# Altium schematic sheet homecomputer-6502_0.SchDoc: homecomputer-6502
size 286 x 202 mm; Date: 2018/12/4 21:08:21; SheetNumber: 1
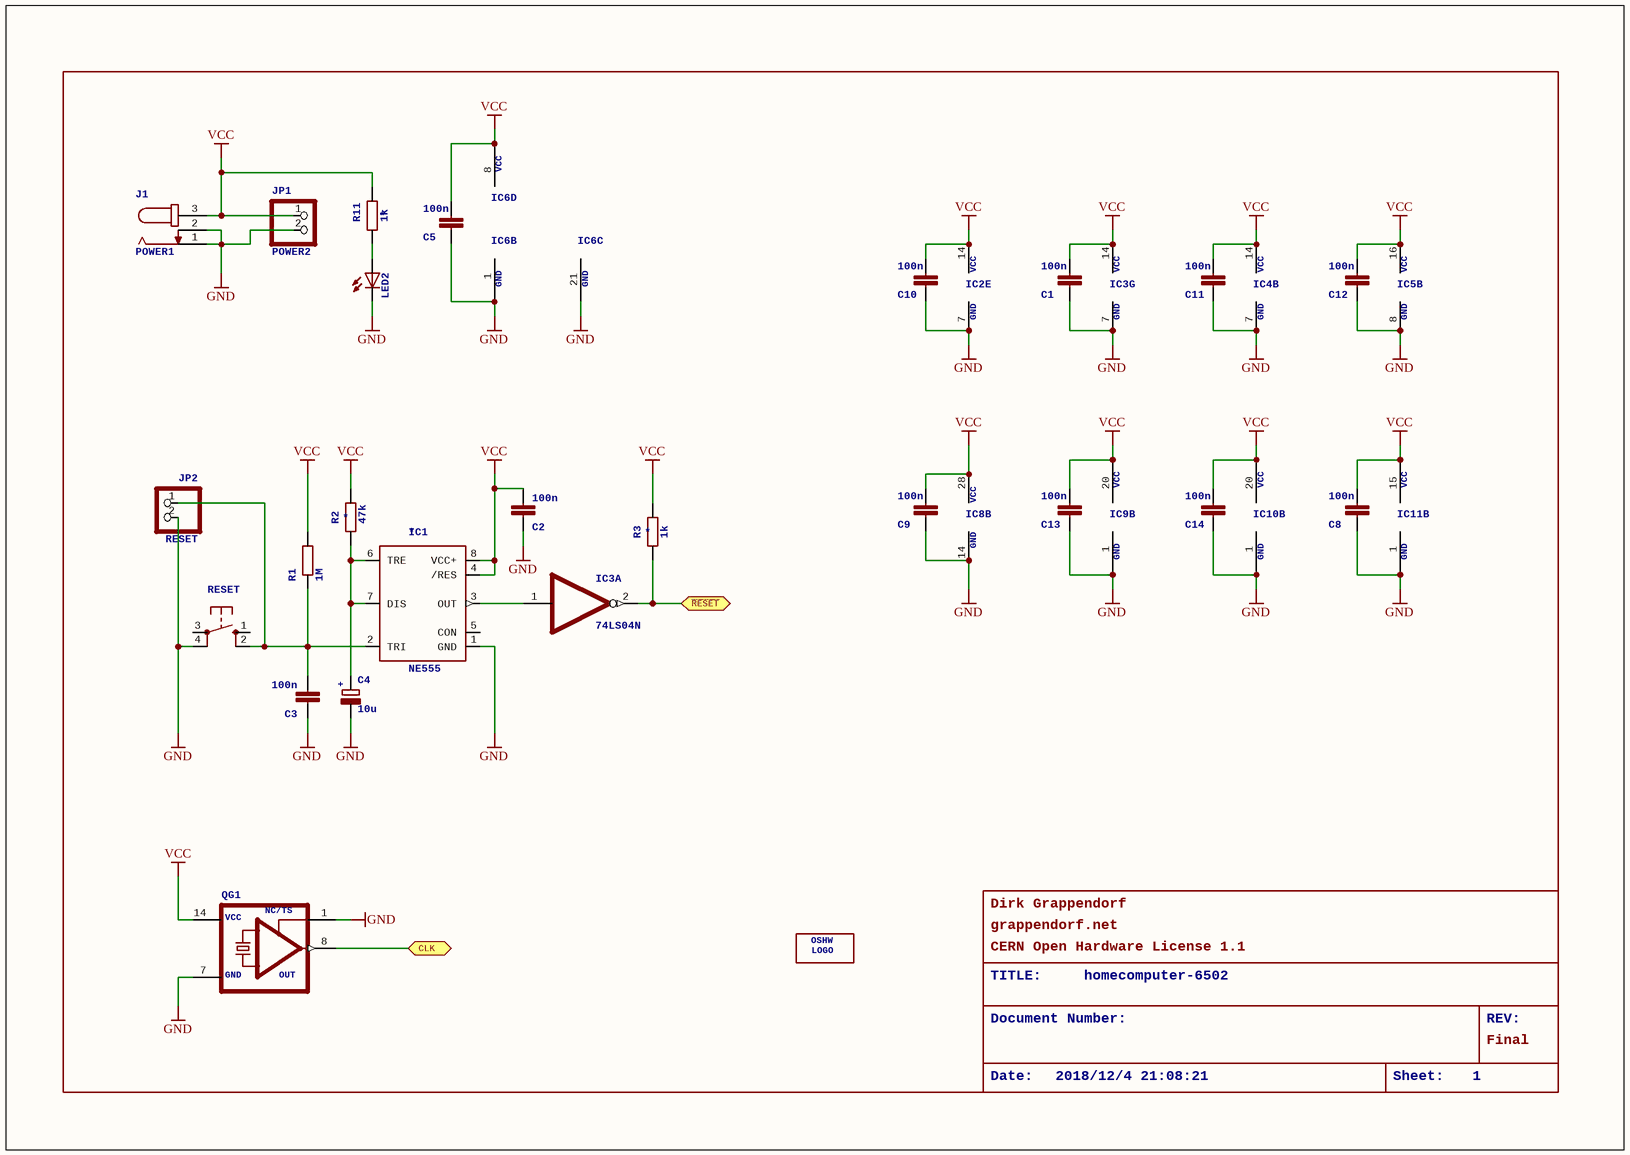
[diagram p0: homecomputer-6502_0.SchDoc]

## Parts
C1  100n  [C025-024X044]
C2  100n  [C025-024X044]
C3  100n  [C025-024X044]
C4  10u  [E2,5-6E]
C5  100n  [C025-024X044]
C8  100n  [C025-024X044]
C9  100n  [C025-024X044]
C10  100n  [C025-024X044]
C11  100n  [C025-024X044]
C12  100n  [C025-024X044]
C13  100n  [C025-024X044]
C14  100n  [C025-024X044]
IC1  NE555  [DIL-08]
IC2  74LS00N  [DIL14]  (value not drawn)  (part E of 5)
IC3  74LS04N  [DIL14]  (parts A,G of 7)
IC4  74*30N  [DIL14]  (value not drawn)  (part B of 2)
IC5  74*137N  [DIL16]  (value not drawn)  (part B of 2)
IC6  6502  [DIP40]  (value not drawn)  (parts B,C,D of 4)
IC8  61256  [DIL28-3]  (value not drawn)  (part B of 2)
IC9  6522  [DIP40]  (value not drawn)  (part B of 2)
IC10  6522  [DIP40]  (value not drawn)  (part B of 2)
IC11  6551  [DIP28]  (value not drawn)  (part B of 2)
J1  POWER1  [SPC4078]
JP1  POWER2  [1X02]
JP2  RESET  [1X02]
LED2  LED3MM  [LED3MM]  (value not drawn)
LOGO1  OSHW_LOGO_8MILX0350-NT  [OSHW_8X350_NOTEXT]  (value not drawn)
QG1  XO-14  [DIL14S]  (value not drawn)
R1  1M  [0204/7]
R2  47k  [0204/7]
R3  1k  [0204/7]
R11  1k  [0204/7]
RESET  10-XX  [B3F-10XX]  (value not drawn)

## Ports
CLK, ~{RESET}

## Nets
GND: C1.1 C2.1 C3.1 C4.- C5.1 C8.1 C9.1 C10.1 C11.1 C12.1 C13.1 C14.1 IC1.1(GND) IC2.7(GND) IC3.7(GND) IC4.7(GND) IC5.8(GND) IC6.1(GND) IC6.21(GND) IC8.14(GND) IC9.1(GND) IC10.1(GND) IC11.1(GND) J1.1 J1.2 JP1.2 JP2.2 LED2.K(C) QG1.1(TS) QG1.7(GND) RESET.4(P1)
VCC: C1.2 C2.2 C5.2 C8.2 C9.2 C10.2 C11.2 C12.2 C13.2 C14.2 IC1.4(/RES) IC1.8(VCC+) IC2.14(VCC) IC3.14(VCC) IC4.14(VCC) IC5.16(VCC) IC6.8(VCC) IC8.28(VCC) IC9.20(VCC) IC10.20(VCC) IC11.15(VCC) J1.3 JP1.1 QG1.14(VCC) R1.2 R2.2 R3.2 R11.2
CLK: QG1.8(OUT) ; port CLK
~{RESET}: IC3.2(O) R3.1 ; port ~{RESET}
NetC3_2: C3.2 IC1.2(TRI) JP2.1 R1.1 RESET.2(S1)
NetC4_+: C4.+ IC1.6(TRE) IC1.7(DIS) R2.1
NetIC1_3: IC1.3(OUT) IC3.1(I)
NetLED2_A: LED2.A R11.1

Not connected (* = marked no-connect by the designer): IC1 5(CON); RESET 1(S) 3(P)

## Notes on the sheet
- Dirk Grappendorf
- grappendorf.net
- CERN Open Hardware License 1.1
- TITLE:
- Document Number:
- homecomputer-6502
- REV:
- Date:
- 2018/12/4 21:08:21
- Sheet:
- 1
- Final

## Library data of the parts
C1-C3 C5 C8-C14 = C-EU025-024X044: CAPACITOR, European symbol
C4 = CPOL-EUE2,5-6E: POLARIZED CAPACITOR, European symbol; +: +
IC1 = NE555: General purpose bipolar Timer; MPN: NE555N; MF: Arrow Electronics; NAME: *; OC_FARNELL: 1467742; OC_NEWARK: 89K1486
IC2 = 74*00N: Quad 2-input NAND gate; GND: GND; VCC: VCC
IC3 = 74*04N: Hex INVERTER
IC4 = 74*30N: 8-input NAND gate; GND: GND; VCC: VCC
IC5 = 74*137N: 3-line to 8-line DECODER/DEMULTIPLEXER, address LATCH; GND: GND; VCC: VCC
IC6 = 6502: 6502 processor; GND: GND
IC8 = 61256: MEMORY; GND: GND; VCC: VCC
IC9 IC10 = 6522: I/O device: two 8-bits ports, handshake lines, timers.; GND: GND; VCC: VCC
IC11 = 6551: ACIA. Capable of RS-232; GND: GND; VCC: VCC
J1 = JACK-PLUG1: DC POWER JACK Power Jack, DC, Right Angle, Through Hole, Rated 5A at 16VDC, PC Terminals   Distributor: Farnell (www.Farnell.de) Drawing: 84N1161.pdf / 84N1162.pdf Manufacturer: SPC Technology (www.spctechnology.com) Type: SPC4077 / SPC 4078; MF: *; MPN: *; OC_FARNELL: unknown; OC_NEWARK: unknown
JP1 JP2 = PINHD-1X2_2.54: PIN HEADER
LED2 = LED3MM: LED   OSRAM: - CHIPLED LG R971, LG N971, LY N971, LG Q971, LY Q971, LO R971, LY R971 LH N974, LH R974 LS Q976, LO Q976, LY Q976 LO Q996 - Hyper CHIPLED LW Q18S LB Q993, LB Q99A, LB R99A - SideLED LS A670, LO A670, LY A670, LG A670, LP A670 LB A673, LV A673, LT A673, LW A673 LH A674 LY A675 LS A676, LA A676, LO A676, LY A676, LW A676 LS A679, LY A679, LG A679 -  Hyper Micro SIDELED庐 LS Y876, LA Y876, LO Y876, LY Y876 LT Y87S - SmartLED LW L88C, LW L88S LB L89C, LB L89S, LG L890 LS L89K, LO L89K, LY L89K LS L896, LA L896, LO L896, LY L896 - TOPLED LS T670, LO T670, LY T670, LG T670, LP T670 LSG T670, LSP T670, LSY T670, LOP T670, LYG T670 LG T671, LOG T671, LSG T671 LB T673, LV T673, LT T673, LW T673 LH T674 LS T676, LA T676, LO T676, LY T676, LB T676, LH T676, LSB T676, LW T676 LB T67C, LV T67C, LT T67C, LS T67K, LO T67K, LY T67K, LW E67C LS E67B, LA E67B, LO E67B, LY E67B, LB E67C, LV E67C, LT E67C LW T67C LS T679, LY T679, LG T679 LS T770, LO T770, LY T770, LG T770, LP T770 LB T773, LV T773, LT T773, LW T773 LH T774 LS E675, LA E675, LY E675, LS T675 LS T776, LA T776, LO T776, LY T776, LB T776 LHGB T686 LT T68C, LB T68C - Hyper Mini TOPLED庐 LB M676 - Mini TOPLED Santana庐 LG M470 LS M47K, LO M47K, LY M47K    Source: http://www.osram.convergy.de   LUXEON: - LUMILED庐 LXK2-PW12-R00, LXK2-PW12-S00, LXK2-PW14-U00, LXK2-PW14-V00 LXK2-PM12-R00, LXK2-PM12-S00, LXK2-PM14-U00 LXK2-PE12-Q00, LXK2-PE12-R00, LXK2-PE12-S00, LXK2-PE14-T00, LXK2-PE14-U00 LXK2-PB12-K00, LXK2-PB12-L00, LXK2-PB12-M00, LXK2-PB14-N00, LXK2-PB14-P00, LXK2-PB14-Q00 LXK2-PR12-L00, LXK2-PR12-M00, LXK2-PR14-Q00, LXK2-PR14-R00 LXK2-PD12-Q00, LXK2-PD12-R00, LXK2-PD12-S00 LXK2-PH12-R00, LXK2-PH12-S00 LXK2-PL12-P00, LXK2-PL12-Q00, LXK2-PL12-R00    Source: www.luxeon.com   KINGBRIGHT:   KA-3528ASYC Source: www.kingbright.com
QG1 = XO-14: CRYSTAL; OUT: OUT; GND: GND; VCC: VCC; NC/TS: NC/TS
R1-R3 R11 = R-EU_0204/7: RESISTOR, European symbol
  R2 R3 R11: NAME: *
RESET = 10-XX: OMRON SWITCH; MPN: B3F-1000; MF: *; OC_FARNELL: 176432; OC_NEWARK: 36M3542
LOGO1 = OSHW_LOGO_8MILX0350-NT: OSHW: OSHW; LOGO: LOGO